# EAGLE design valve board (EAGLE 7.5.0)
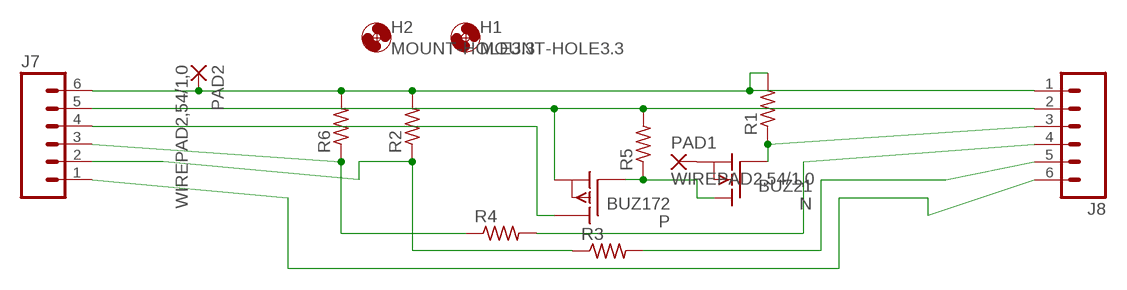
[diagram p0: schematic, sheet 1]

## Parts
H1  MOUNT-HOLE3.3  [3,3]
H2  MOUNT-HOLE3.3  [3,3]
J7  M06LOCK_LONGPADS  [1X06_LOCK_LONGPADS]
J8  M06LOCK_LONGPADS  [1X06_LOCK_LONGPADS]
N  BUZ21  [TO220]
P  BUZ172  [TO220]
PAD1  WIREPAD2,54/1,0  [2,54/1,0]
PAD2  WIREPAD2,54/1,0  [2,54/1,0]
R1  R-US_0207/10  [0207/10]
R2  R-US_0207/10  [0207/10]
R3  R-US_0207/10  [0207/10]
R4  R-US_0207/10  [0207/10]
R5  R-US_0207/10  [0207/10]
R6  R-US_0207/10  [0207/10]

## Nets
GND: J7.6 J8.1 PAD2.1(P) R1.2 R2.2 R6.2
N$1: J8.4 R4.2
N$2: J8.5 R3.2
N$3: J7.4 P.2(D)
N$4: J7.5 J8.2 P.3(S) R5.2
N$6: J7.2 R2.1 R3.1
N$8: N.2(D) P.1(G) R5.1
N$9: J8.3 N.1(G) R1.1
N$10: J7.3 R4.1 R6.1
N$12: J7.1 J8.6
N$13: N.3(S) PAD1.1(P)

## Library data of the parts
H1 H2 = holes:MOUNT-HOLE: MOUNTING HOLE with drill center marker
J7 J8 = SparkFun-Connectors:M06: Header 6 Standard 6-pin 0.1" header. Use with straight break away headers (SKU : PRT-00116), right angle break away headers (PRT-00553), swiss pins (PRT-00743), machine pins (PRT-00117), and female headers (PRT-00115). Molex polarized connector foot print use with SKU : PRT-08094 with associated crimp pins and housings. NOTES ON THE VARIANTS LOCK and LOCK_LONGPADS... This footprint was designed to help hold the alignment of a through-hole component (i.e. 6-pin header) while soldering it into place. You may notice that each hole has been shifted either up or down by 0.005 of an inch from it's more standard position (which is a perfectly straight line). This slight alteration caused the pins (the squares in the middle) to touch the edges of the holes. Because they are alternating, it causes a "brace" to hold the component in place. 0.005 has proven to be the perfect amount of "off-center" position when using our standard breakaway headers. Although looks a little odd when you look at the bare footprint, once you have a header in there, the alteration is very hard to notice. Also,if you push a header all the way into place, it is covered up entirely on the bottom side. This idea of altering the position of holes to aid alignment will be further integrated into the Sparkfun Library for other footprints. It can help hold any component with 3 or more connection pins.
N = transistor-fet:BUZ21: N-Channel Enhancement MOSFET 100V; 19A; 0,1Ohm
P = transistor-fet:BUZ172: P-Channel Enhancement MOSFET -100V; -5A; 0,8Ohm
PAD1 PAD2 = wirepad:WIREPAD: Wire PAD connect wire on PCB
R1-R6 = resistor:R-US_: RESISTOR, American symbol

## Board
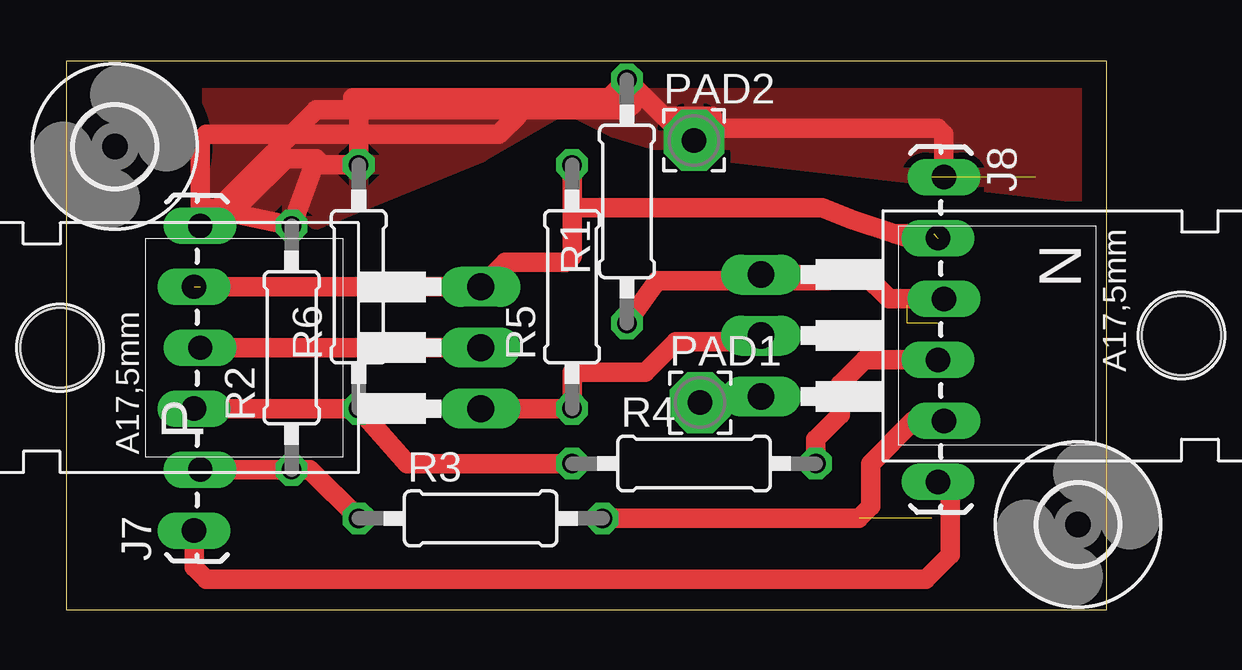
[diagram p1: board, top side]

Size 43.36 x 22.85 mm. Coordinates in mm from the lower left corner, seen from the top.
Outline: 0,0 43.36,0 43.36,22.85 0,22.85 0,0
Copper layers (1*16): Top 0.035mm / dielectric 1.5mm / Bottom 0.035mm
Design rules "default": minimum track width 10mil, minimum drill 24mil, track to track 8mil, track to pad 8mil, pad to pad 8mil, via to via 8mil, smd to smd 8mil, copper to edge 40mil, drill to drill 8mil, minimum pad ring 10mil, minimum via ring 8mil, stop-mask expansion 4mil, vias tented up to drill 0mil, thermal gap 10mil

### Footprints (pad centres in the part's own frame; a part is rotated, then mirrored left to right if it is on the bottom)
3,3 = hole 3.3: 0,0
1X06_LOCK_LONGPADS = drill 1.016 long: 1 0,0; 2 2.54,-0.254; 3 5.08,0; 4 7.62,-0.254; 5 10.16,0; 6 12.7,-0.254
TO220 = drill 1.118 long: 1 -2.54,-6.35; 2 0,-6.35; 3 2.54,-6.35 | hole 3.302: 0,11.176
2,54/1,0 = drill 1.016 pad 2.54 octagon: 1 0,0
0207/10 = drill 0.813 octagon: 1 -5.08,0; 2 5.08,0

### Placement (x,y rotation side)
H1  2.03,19.3 0 top
H2  42.16,3.56 0 top
J7  5.33,3.3 90 top
J8  36.58,18.03 270 top
N  35.31,11.43 270 top
P  10.92,10.92 90 top
PAD1  26.42,8.64 0 top
PAD2  26.16,19.56 0 top
R1  23.37,17.02 90 top
R2  9.4,10.92 90 top
R3  17.27,3.81 0 top
R4  26.16,6.1 0 top
R5  21.08,13.46 90 top
R6  12.19,13.46 90 top

### Tracks (layer width: path | path; a pad name or v marks a point on that pad's centre or on a via)
GND
  Top 0.813: 7.37,17.27 7.37,17.02 9.14,18.8 10.41,18.8 | 10.41,18.8 R2.2 5.84,16.76 | 10.41,18.8 10.67,18.54 R6.2 12.19,21.08 11.94,21.34 19.05,21.34 | 19.05,21.34 22.61,21.34 R1.2 23.62,21.84 | 24.89,20.57 25.4,20.07 36.32,20.07 36.58,19.81 J8.1 | 19.05,21.34 18.8,21.08 18.8,20.57 18.03,19.81 5.84,19.81 5.59,19.56 J7.6 10.41,20.83 23.37,20.83 23.62,21.08 23.62,21.84 | PAD2.1 26.16,19.81 26.92,20.57 24.89,20.57 | 24.89,20.57 23.62,21.84
  pour Top: 10.41,16.76 3.56,16.76 3.56,21.34 42.93,21.34 42.93,17.27 25.4,19.3 22.86,20.07 20.83,21.08 17.27,19.05 10.41,16.26
N$1
  Top 0.813: J8.4 33.27,10.41 32.26,9.4 32.26,8.13 31.24,7.11 R4.2
N$2  (1 unrouted)
  Top 0.813: R3.2 33.02,3.81 33.53,4.32 33.53,6.1 35.31,7.87 J8.5
N$3
  Top 0.813: 17.02,10.67 P.2 J7.4
N$4  (2 unrouted)
  Top 0.254: 36.2,15.16 35.81,15.24
  Top 0.813: 21.08,16.76 21.08,14.73 20.83,14.48 18.29,14.48 P.3 5.59,13.46 | 21.08,16.76 R5.2 | 35.81,15.24 34.52,15.67 | 34.52,15.67 32.77,16.26 31.5,16.76 21.08,16.76 | 36.14,15.67 34.52,15.67
N$6
  Top 0.813: J7.2 R2.1 10.16,5.84 R3.1
N$7  (2 unrouted)
N$8
  Top 0.813: P.1 R5.1 21.08,9.91 24.13,9.91 25.4,11.18 28.7,11.18 N.2
N$9
  Top 0.813: 31.75,13.72 29.46,13.72 | 29.46,13.72 28.96,13.72 | 28.96,13.72 N.1 | R1.1 24.64,13.72 28.96,13.72 | J8.3 34.29,12.95 33.27,13.97 29.72,13.97 29.46,13.72
N$10
  Top 0.813: 5.59,8.38 R6.1 | R6.1 J7.3 | R4.1 14.22,6.1 R6.1
N$11  (1 unrouted)
N$12
  Top 0.813: J7.1 5.33,1.78 5.84,1.27 35.81,1.27 36.83,2.29 36.83,4.83 J8.6
N$13
  Top 0.813: N.3 27.18,8.89 PAD1.1